# Altium schematic sheet MCU.SchDoc
size 384 x 270 mm; SheetNumber: 2; SheetTotal: 4
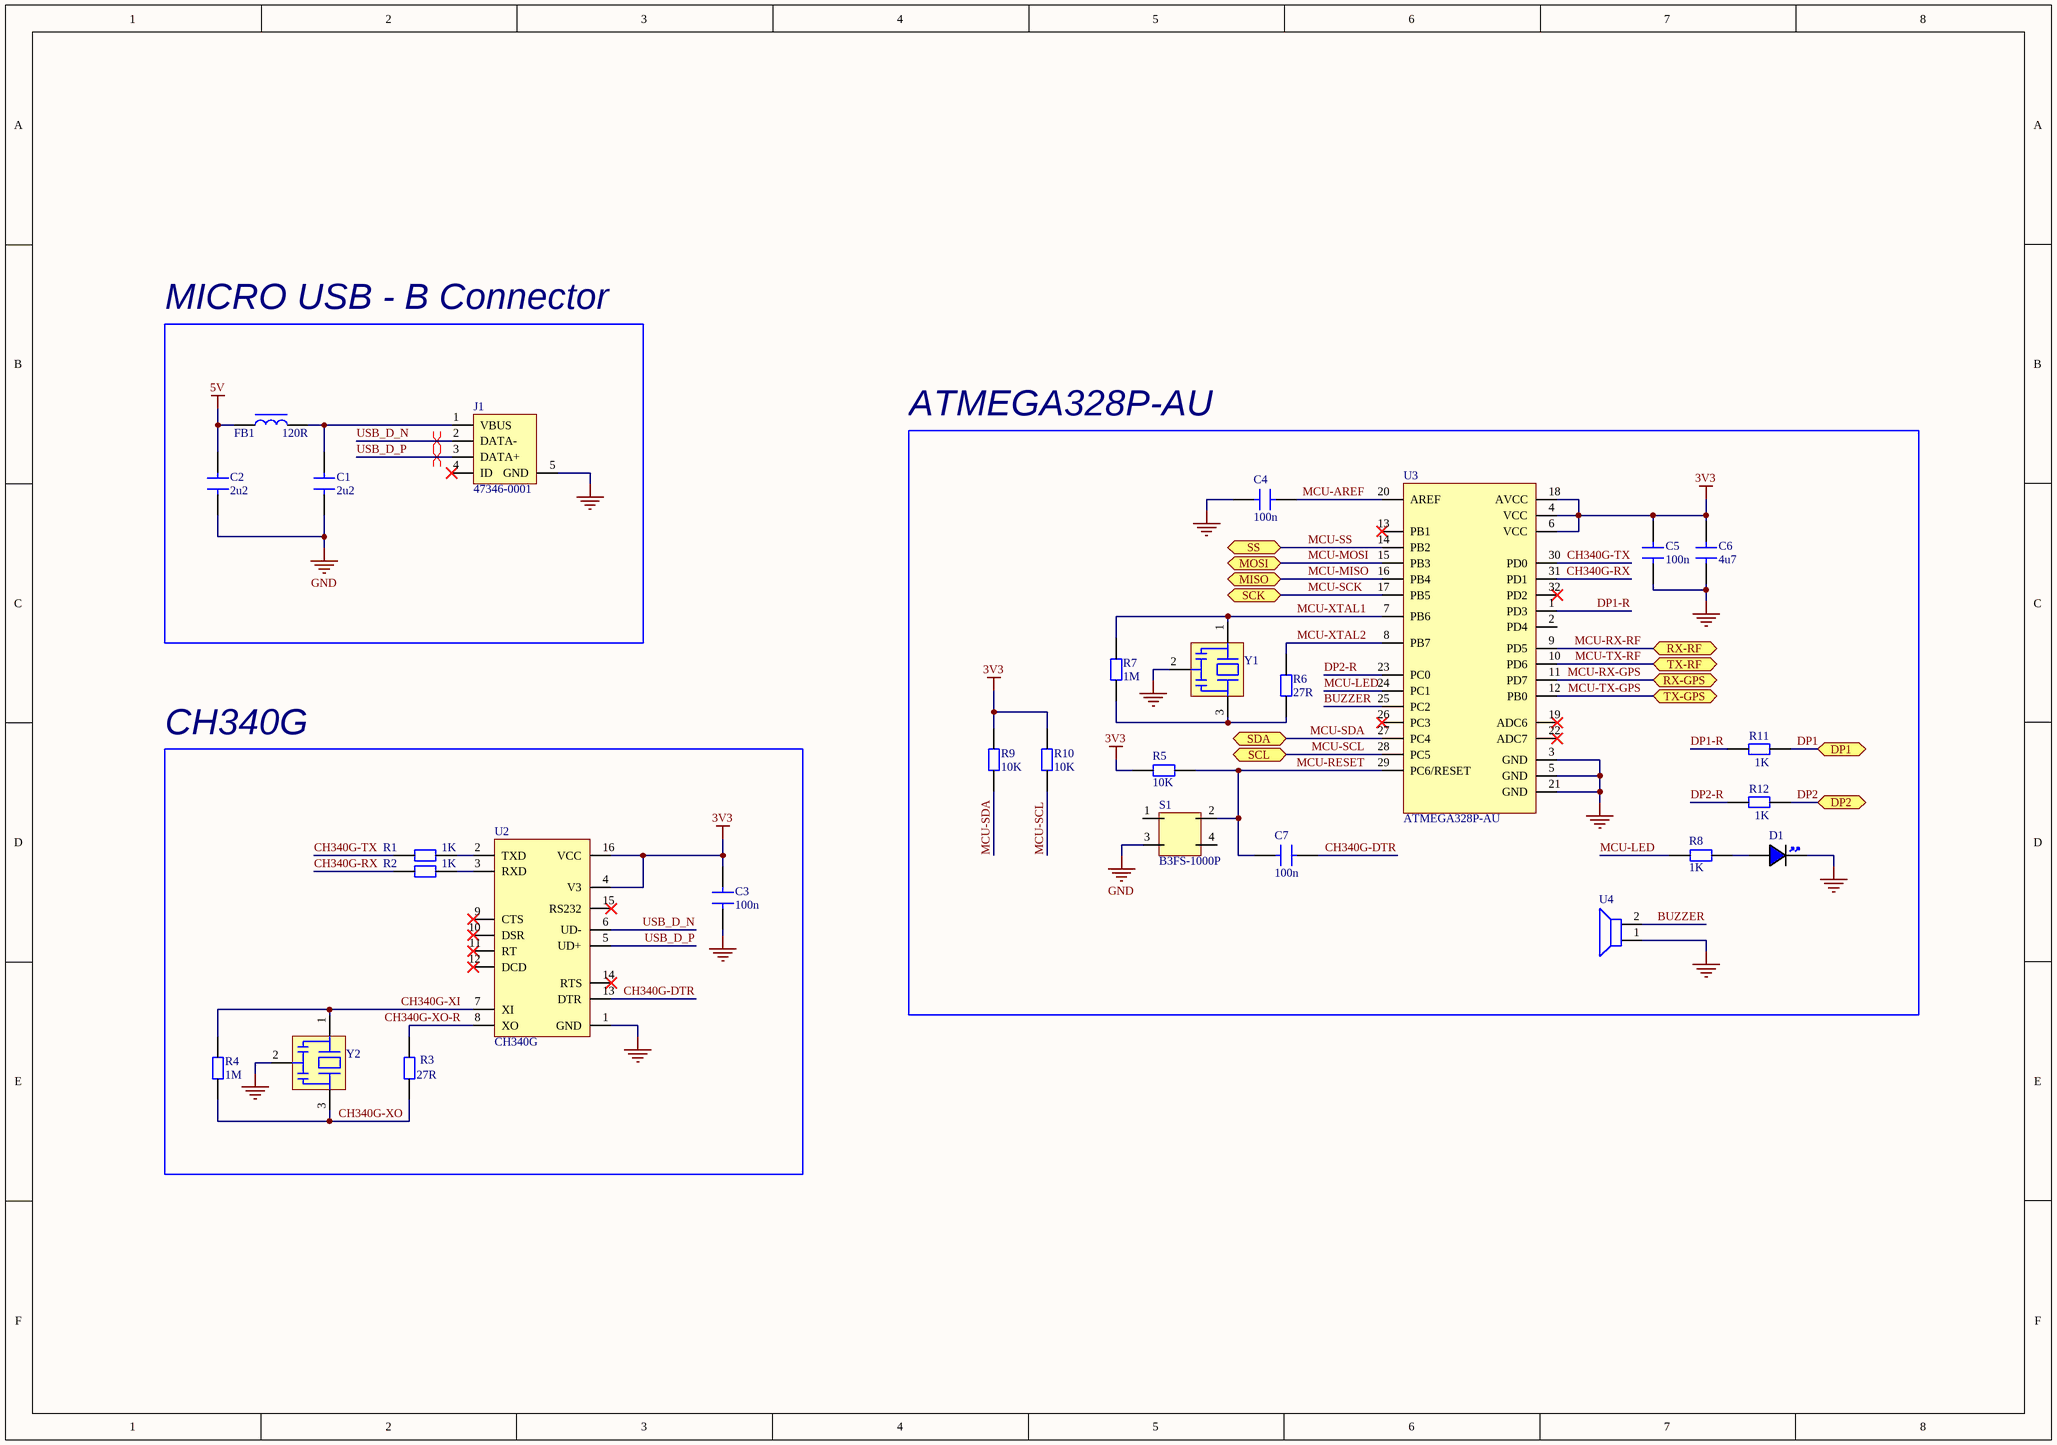
[diagram p0: MCU.SchDoc]

## Parts
C1  2u2  [CAP 0603]
C2  2u2  [CAP 0603]
C3  100n  [CAP 0603]
C4  100n  [CAP 0603]
C5  100n  [CAP 0603]
C6  4u7  [CAP 0603]
C7  100n  [CAP 0603]
D1  LED 0805 BLUE  [LED 0805 BLUE]  (value not drawn)
FB1  120R  [FB 0805]
J1  47346-0001  [MOLEX_47346-0001]
R1  1K  [RES 0603]
R2  1K  [RES 0603]
R3  27R  [RES 0603]
R4  1M  [RES 0603]
R5  10K  [RES 0603]
R6  27R  [RES 0603]
R7  1M  [RES 0603]
R8  1K  [RES 0603]
R9  10K  [RES 0603]
R10  10K  [RES 0603]
R11  1K  [RES 0603]
R12  1K  [RES 0603]
S1  B3FS-1000P  [B3FS-1000P]
U2  CH340G  [CH340G]
U3  ATMEGA328P-AU  [ATMEGA328P-AU]
U4  PS1240P02BT  [PS1240P02BT]  (value not drawn)
Y1  CSTNE16M0V53Z000R0  [CSTNE16M0V53Z000R0]  (value not drawn)
Y2  CSTNE12M0G550000R0  [CSTNE16M0V53Z000R0]  (value not drawn)

## Blocks framed on the sheet
MICRO USB - B Connector: C1 C2 FB1 J1
ATMEGA328P-AU: C4-C7 D1 R5-R12 S1 U3 U4 Y1
CH340G: C3 R1-R4 U2 Y2

## Ports
DP1 (bidir, see Power[1C]), DP2 (bidir, see Power[2C]), MISO (bidir, see Peripheral[1C], Peripheral[3D]), MOSI (bidir, see Peripheral[1C], Peripheral[3D]), RX-GPS (bidir, see Peripheral[4D]), RX-RF (bidir, see Peripheral[3D]), SCK (bidir, see Peripheral[1D], Peripheral[3D]), SCL (bidir, see Peripheral[2B], Peripheral[3A], Peripheral[3D]), SDA (bidir, see Peripheral[2A], Peripheral[3A], Peripheral[3D]), SS (bidir, see Peripheral[1C], Peripheral[3D]), TX-GPS (bidir, see Peripheral[4D]), TX-RF (bidir, see Peripheral[3D])

## Nets
3V3: C3.2 C5.2 C6.2 R5.1 R9.2 R10.2 U2.4(V3) U2.16(VCC) U3.4(VCC) U3.6(VCC) U3.18(AVCC)
5V: C2.1 FB1.1
GND: C1.2 C2.2 C3.1 C4.2 C5.1 C6.1 D1.K J1.5(GND) S1.3 U2.1(GND) U3.3(GND) U3.5(GND) U3.21(GND) U4.1 Y1.2 Y2.2
BUZZER: U3.25(PC2) U4.2
CH340G-DTR: C7.1 U2.13(DTR)
CH340G-RX: R2.2 U3.31(PD1)
CH340G-TX: R1.2 U3.30(PD0)
CH340G-XI: R4.2 U2.7(XI) Y2.1
CH340G-XO: R3.1 R4.1 Y2.3
CH340G-XO-R: R3.2 U2.8(XO)
DP1: R11.2 ; port DP1
DP1-R: R11.1 U3.1(PD3)
DP2: R12.2 ; port DP2
DP2-R: R12.1 U3.23(PC0)
MCU-AREF: C4.1 U3.20(AREF)
MCU-LED: R8.1 U3.24(PC1)
MCU-MISO: U3.16(PB4) ; port MISO
MCU-MOSI: U3.15(PB3) ; port MOSI
MCU-RESET: C7.2 R5.2 S1.2 U3.29(PC6/RESET)
MCU-RX-GPS: U3.11(PD7) ; port RX-GPS
MCU-RX-RF: U3.9(PD5) ; port RX-RF
MCU-SCK: U3.17(PB5) ; port SCK
MCU-SCL: R10.1 U3.28(PC5) ; port SCL
MCU-SDA: R9.1 U3.27(PC4) ; port SDA
MCU-SS: U3.14(PB2) ; port SS
MCU-TX-GPS: U3.12(PB0) ; port TX-GPS
MCU-TX-RF: U3.10(PD6) ; port TX-RF
MCU-XTAL1: R7.2 U3.7(PB6) Y1.1
MCU-XTAL2: R6.2 U3.8(PB7)
USB_D_N: J1.2(DATA-) U2.6(UD-)
USB_D_P: J1.3(DATA+) U2.5(UD+)
NetC1_1: C1.1 FB1.2 J1.1(VBUS)
NetD1_A: D1.A R8.2
NetR1_1: R1.1 U2.2(TXD)
NetR2_1: R2.1 U2.3(RXD)
NetR6_1: R6.1 R7.1 Y1.3

Not connected (* = marked no-connect by the designer): J1 4(ID)*; S1 1 4; U2 9(CTS)* 10(DSR)* 11(RT)* 12(DCD)* 14(RTS)* 15(RS232)*; U3 2(PD4) 13(PB1)* 19(ADC6)* 22(ADC7)* 26(PC3)* 32(PD2)*

## Layout directives
differential pair; differential pair class DIFF_USB: USB_D_N, USB_D_P

## Notes on the sheet
- DWG NO:
- REV:
- THIS DOCUMENT AND THE DATA DISCLOSED HEREIN OR
- HEREWITH IS THE PROPERTY OF ALTIUM LIMITED AND MAY
- BE FREELY DISTRIBUTED IN WHOLE. NO RIGHTS ARE
- RESERVED OR EXPRESS OR IMPLIED WARANTEE GIVEN.
- REVISION
- DESCRIPTION
- DATE
- APPROVED
- ENG:
- APPROVALS
- PROJECT
- DSN:
- CHK:
- REFERENCE DOCUMENTS
- PROJECT REVISION:
- TITLE
- DOCUMENT REVISION:
- DESIGN ITEM:
- BOM:
- FAB DWG:
- PCB DWG:
- ASSY DWG:
- SCALE:
- A2
- SIZE
- CAGE CODE
- FILE NAME
- DWG NO.
- SHEET
- OF
- REV

## Library data of the parts
C1-C7 = CAP 0603 50V: Capacitor SMD 0603 50V
D1 = LED 0805 BLUE: LED 0805 GREEN SMD
FB1 = FB 0805: Ferrite Bead SMD 0805
J1 = 47346-0001: Micro-USB B Receptacle with Flange, Bottom Mount, Surface Mount, Lead-Free; Manufacturer: Molex; Max Voltage Rating (AC): 30V; Number of Ports: 1; Contact Resistance: 40mR; Current Rating: 1.8A; Gender: Female; Connector Type: USB,Receptacle; Number of Contacts: 5; Contact Current Rating: 1A; USB Standard: USB 2.0; Pitch: 0.65mm; Glow Wire Compliant: Non-compliant; Supplier 1: Sager Electronics; Manufacturer Part Number: 47346-0001; RoHS: Yes; Category: Headers and Wire Housings; Stock 1: 14156; Pricing 1: 14000=0,5225 (USD); Mount: Surface Mount; Contact Plating: Gold; Contact Material: Copper Alloy,Copper; Housing Material: Polymer; Color: Black; Min Operating Temperature: -20°C; Max Operating Temperature: 85°C; Packaging: Tape and Reel; Termination: SMD/SMT; Orientation: Right Angle; Voltage Rating (AC): 30V; Voltage Rating: 30V; Number of Circuits: 5; Number of Positions: 5; Number of Rows: 1; Series: 47346; RoHS Compliant: Yes; Halogen Free: Low Halogen; Lead Free: Lead Free; Flammability Rating: UL94 V-0; Reach SVHC Compliant: Unknown; ComponentLink1URL: https://datasheet.ciiva.com/30075/304740473460001-io-nectors-30075527.pdf?src-supplier=Onlinecomponents.com; ComponentLink1Description: https://datasheet.ciiva.com/30075/304740473460001-io-nectors-30075527.pdf?src-supplier=Onlinecomponents.com; ComponentLink2URL: https://datasheet.ciiva.com/22654/1630785-22654942.pdf?src-supplier=Element14; ComponentLink2Description: https://datasheet.ciiva.com/22654/1630785-22654942.pdf?src-supplier=Element14; ComponentLink3URL: https://datasheet.ciiva.com/16148/1700180473460001-io-nectors-16148917.pdf?src-supplier=Onlinecomponents.com; ComponentLink3Description: https://datasheet.ciiva.com/16148/1700180473460001-io-nectors-16148917.pdf?src-supplier=Onlinecomponents.com; ComponentLink4URL: https://datasheet.ciiva.com/16986/70266948-16986683.pdf?src-supplier=Allied+Electronics; ComponentLink4Description: https://datasheet.ciiva.com/16986/70266948-16986683.pdf?src-supplier=Allied+Electronics; ComponentLink5URL: https://datasheet.ciiva.com/28504/0473460001-io-connectors-28504587.pdf?src-supplier=Element14; ComponentLink5Description: https://datasheet.ciiva.com/28504/0473460001-io-connectors-28504587.pdf?src-supplier=Element14; ComponentLink6URL: https://datasheet.ciiva.com/46390/1681853-46390956.pdf?src-supplier=Element14; ComponentLink6Description: https://datasheet.ciiva.com/46390/1681853-46390956.pdf?src-supplier=Element14
R1-R12 = RES 0603: Resistor SMD 0603
S1 = B3FS-1000P: Switch Tactile N.O. SPST Flat Round Button Gull Wing 0.05A 24VDC 0.98N SMD T/R; Manufacturer: Omron; Mechanical Life: 1000000Cycles; Actuator Color: Black; Current Rating: 50mA; Voltage Rating (DC): 24V; Contact Resistance: 100mR; Illumination Type: Non-Illuminated,Illuminated; Number of Poles: 1; Switch Travel: 0.25mm; Switch Function: Off-Mom; Actuator Type: Standard; Actuator Length: 0.5mm; Ratings: IP00; Supplier 1: Sager Electronics; Manufacturer Part Number: B3FS-1000P; RoHS: Yes; Category: Tactile Switches; Stock 1: 12000; Pricing 1: 3000=0,316, 12000=0,305 (USD); Mount: Surface Mount; Case/Package: SMD/SMT; Contact Plating: Silver; Weight: 0.2g; Contact Material: Silver; Material: Plastic; Min Operating Temperature: -20°C; Max Operating Temperature: 70°C; Package Quantity: 3000; Operating Force: 0.98N; Packaging: Tape and Reel; Contact Current Rating: 50mA; Throw Configuration: SPST; Max Current Rating: 50mA; Max Voltage Rating (DC): 24V; Termination: Gull Wing; Electrical Life: 1000000Cycles; Orientation: Straight; Series: B3FS; Length: 6.3mm; Depth: 8mm; Lead Free: Lead Free; RoHS Compliant: Yes; Reach SVHC Compliant: Unknown; ComponentLink1URL: https://datasheet.ciiva.com/1532/en-b3fs-1532627.pdf?src-supplier=Element14; ComponentLink1Description: https://datasheet.ciiva.com/1532/en-b3fs-1532627.pdf?src-supplier=Element14; ComponentLink2URL: https://datasheet.ciiva.com/16154/en-b3fs-16154936.pdf?src-supplier=Onlinecomponents.com; ComponentLink2Description: https://datasheet.ciiva.com/16154/en-b3fs-16154936.pdf?src-supplier=Onlinecomponents.com; ComponentLink3URL: https://datasheet.ciiva.com/26827/getdatasheetpartid-131603-26827237.pdf?src-supplier=Verical; ComponentLink3Description: https://datasheet.ciiva.com/26827/getdatasheetpartid-131603-26827237.pdf?src-supplier=Verical; ComponentLink4URL: https://datasheet.ciiva.com/30214/b3fs-0714-30214221.pdf?src-supplier=Onlinecomponents.com; ComponentLink4Description: https://datasheet.ciiva.com/30214/b3fs-0714-30214221.pdf?src-supplier=Onlinecomponents.com; ComponentLink5URL: https://datasheet.ciiva.com/2899/en-b3fs-2899745.pdf?src-supplier=Digi-Key; ComponentLink5Description: https://datasheet.ciiva.com/2899/en-b3fs-2899745.pdf?src-supplier=Digi-Key; ComponentLink6URL: https://datasheet.ciiva.com/2899/en-b3fs-2899746.pdf?src-supplier=Digi-Key; ComponentLink6Description: https://datasheet.ciiva.com/2899/en-b3fs-2899746.pdf?src-supplier=Digi-Key; ComponentLink7URL: https://datasheet.ciiva.com/2899/en-b3fs-2899744.pdf?src-supplier=Digi-Key; ComponentLink7Description: https://datasheet.ciiva.com/2899/en-b3fs-2899744.pdf?src-supplier=Digi-Key
U2 = CH340G: USB Interface Integrated Circuit
U3 = ATMEGA328P-AU: 8-bit AVR MCU, 32 KB, 2048 Bytes, 20 MHz, 1.8 to 5.5V, TQFP-32, RoHS; Manufacturer: Microchip; Interface: I2C,SPI,USART; Number of I/Os: 23; Oscillator Type: Internal; Memory Type: FLASH; Memory Size: 32KB; Peripherals: Brown-out Detect/Reset,POR,PWM,WDT; Frequency: 20MHz; RAM Size: 2KB; Min Supply Voltage: 1.8V; Number of Timers/Counters: 3; Number of ADC Channels: 8; Number of PWM Channels: 6; Data Bus Width: 8b; Number of SPI Channels: 1; Watchdog Timer: Yes; Supplier 1: Farnell; Manufacturer Part Number: ATMEGA328P-AU; RoHS: Yes; Stock 1: 196910; Pricing 1: 1=3,05, 25=2,48, 100=2,42, 250=2,37 (EUR); Mount: Surface Mount; Case/Package: A; Number of Pins: 32; Weight: 0.002469oz; Min Operating Temperature: -40°C; Max Operating Temperature: 85°C; Packaging: Tray; Core Architecture: AVR; Series: ATmega328P; Package Quantity: 250; Max Supply Voltage: 5.5V; Number of Programmable I/O: 23; Max Frequency: 20MHz; Number of I2C Channels: 1; Length: 7mm; Width: 7mm; Height: 1mm; Radiation Hardening: No; RoHS Compliant: Yes; Reach SVHC Compliant: Yes; Lead Free: Lead Free; ComponentLink1URL: https://datasheet.ciiva.com/1166/doc8161-1166860.pdf?src-supplier=Newark; ComponentLink1Description: https://datasheet.ciiva.com/1166/doc8161-1166860.pdf?src-supplier=Newark; ComponentLink2URL: https://datasheet.ciiva.com/29119/155196-da-01-en-microcontr-atmega328p-au-8bit-tqfp-32-29119594.pdf?src-supplier=Conrad; ComponentLink2Description: https://datasheet.ciiva.com/29119/155196-da-01-en-microcontr-atmega328p-au-8bit-tqfp-32-29119594.pdf?src-supplier=Conrad; ComponentLink3URL: https://datasheet.ciiva.com/1157/1693866-1157693.pdf?src-supplier=Element14; ComponentLink3Description: https://datasheet.ciiva.com/1157/1693866-1157693.pdf?src-supplier=Element14; ComponentLink4URL: https://datasheet.ciiva.com/15213/getdatasheetpartid-365828-15213131.pdf?src-supplier=Verical; ComponentLink4Description: https://datasheet.ciiva.com/15213/getdatasheetpartid-365828-15213131.pdf?src-supplier=Verical
U4 = PS1240P02BT: Audio Buzzer Piezo 30Vo-p 3Vo-p 70dBA Through Hole Pin Ammo; Manufacturer: TDK; Supplier 1: CoreStaff; Manufacturer Part Number: PS1240P02BT; RoHS: Yes; Category: Audio Products; Stock 1: 34; Pricing 1: 1=156, 10=90, 50=60, 100=45, 500=39, 1000=34,5, 2000=30, 4000=29,1 (JPY); ComponentLink1URL: https://datasheet.ciiva.com/0/ef532-ps-112.pdf?src-supplier=Digi-Key; ComponentLink1Description: https://datasheet.ciiva.com/0/ef532-ps-112.pdf?src-supplier=Digi-Key; ComponentLink2URL: https://datasheet.ciiva.com/0/ef532-ps-111.pdf?src-supplier=Digi-Key; ComponentLink2Description: https://datasheet.ciiva.com/0/ef532-ps-111.pdf?src-supplier=Digi-Key; ComponentLink3URL: https://datasheet.ciiva.com/3306/ef532-ps-3306958.pdf?src-supplier=Avnet; ComponentLink3Description: https://datasheet.ciiva.com/3306/ef532-ps-3306958.pdf?src-supplier=Avnet; ComponentLink4URL: https://datasheet.ciiva.com/16225/ef532-ps-16225062.pdf?src-supplier=Onlinecomponents.com; ComponentLink4Description: https://datasheet.ciiva.com/16225/ef532-ps-16225062.pdf?src-supplier=Onlinecomponents.com
Y1 = CSTNE16M0V53Z000R0: Ceramic Resonator 16MHz ±0.5% (Tol) ±0.3% (Stability) 15pF 40Ohm 3-Pin CSMD T/R; Manufacturer: Murata; Impedance: 40R; Supplier 1: Arrow Electronics; Manufacturer Part Number: CSTNE16M0V53Z000R0; RoHS: Yes; Category: Resonators; Stock 1: 87000; Pricing 1: 3000=0,1298, 6000=0,1244, 15000=0,1189 (USD); Mount: Surface Mount; Case/Package: SMD/SMT; Min Operating Temperature: -40°C; Max Operating Temperature: 125°C; Packaging: Cut Tape; Frequency: 16MHz; Frequency Stability: 0.3%; Frequency Tolerance: 0.5%; Capacitance: 15pF; Series: CERALOCK® CSTNE; RoHS Compliant: Yes; ComponentLink1URL: https://www.murata.com/en/products/productdata/8801162199070/SPEC-CSTNE16M0V53Z000R0.pdf?src-supplier=Digi-Key; ComponentLink1Description: https://www.murata.com/en/products/productdata/8801162199070/SPEC-CSTNE16M0V53Z000R0.pdf?src-supplier=Digi-Key
Y2 = CSTNE12M0G550000R0: Ceramic Resonator 12MHz ±0.5% (Tol ) ±0.2% (Stability) 33PF 30Ohm 3-Pin CSMD; Manufacturer: Murata; Supplier 1: CoreStaff; Manufacturer Part Number: CSTNE12M0G550000R0; RoHS: Yes; Category: Resonators; Stock 1: 10; Pricing 1: 1=77,6, 10=58,2, 50=36,86, 100=27,16, 500=17,46, 1000=15,52, 2000=14,55, 4000=14,36 (JPY); ComponentLink1URL: https://www.murata.com/en/products/productdata/8801162067998/SPEC-CSTNE12M0G550000R0.pdf?src-supplier=Digi-Key; ComponentLink1Description: https://www.murata.com/en/products/productdata/8801162067998/SPEC-CSTNE12M0G550000R0.pdf?src-supplier=Digi-Key; ComponentLink2URL: https://datasheet.octopart.com/CSTNE12M0G550000R0-Murata-datasheet-137044759.pdf?src-supplier=Future+Electronics; ComponentLink2Description: https://datasheet.octopart.com/CSTNE12M0G550000R0-Murata-datasheet-137044759.pdf?src-supplier=Future+Electronics; ComponentLink3URL: https://datasheet.octopart.com/CSTNE12M0G550000R0-Murata-datasheet-165611788.pdf?src-supplier=TME; ComponentLink3Description: https://datasheet.octopart.com/CSTNE12M0G550000R0-Murata-datasheet-165611788.pdf?src-supplier=TME